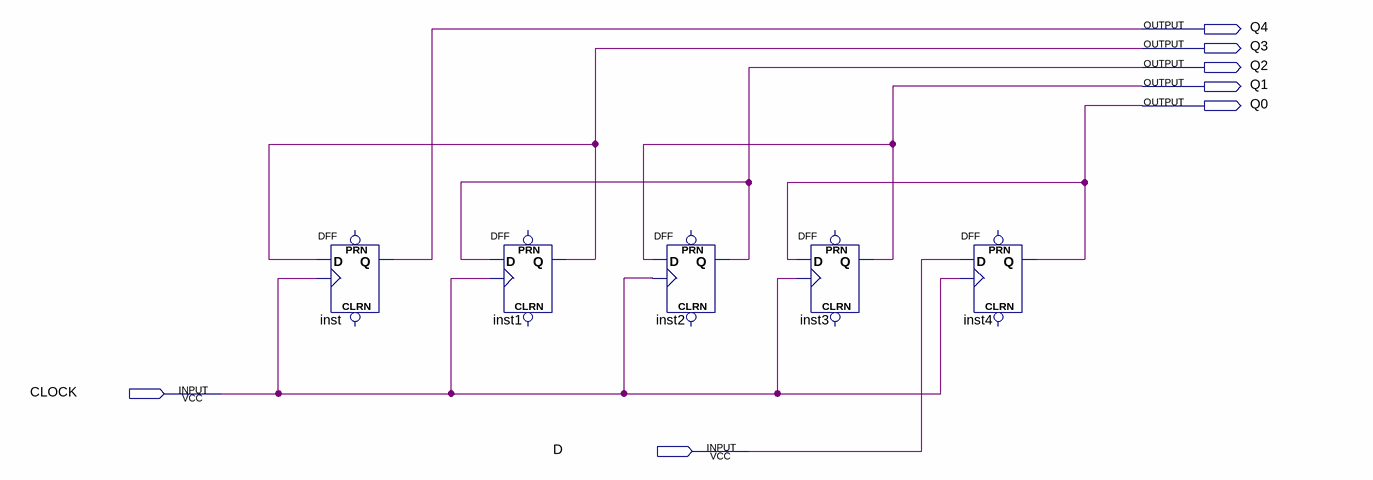
[diagram p0: schematic sheet]
// Quartus schematic ex2.bdf as structural Verilog: 5 symbols, 7 pins
module ex2 (
  input  CLOCK,
  input  D,
  output Q4,
  output Q3,
  output Q2,
  output Q1,
  output Q0
);

  DFF inst (.CLK(CLOCK), .D(Q3), .Q(Q4));  // open: CLRN, PRN
  DFF inst1 (.CLK(CLOCK), .D(Q2), .Q(Q3));  // open: CLRN, PRN
  DFF inst2 (.CLK(CLOCK), .D(Q1), .Q(Q2));  // open: CLRN, PRN
  DFF inst3 (.CLK(CLOCK), .D(Q0), .Q(Q1));  // open: CLRN, PRN
  DFF inst4 (.CLK(CLOCK), .D(D), .Q(Q0));  // open: CLRN, PRN
endmodule
